# Altium schematic sheet BANK12-13.SchDoc
size A4
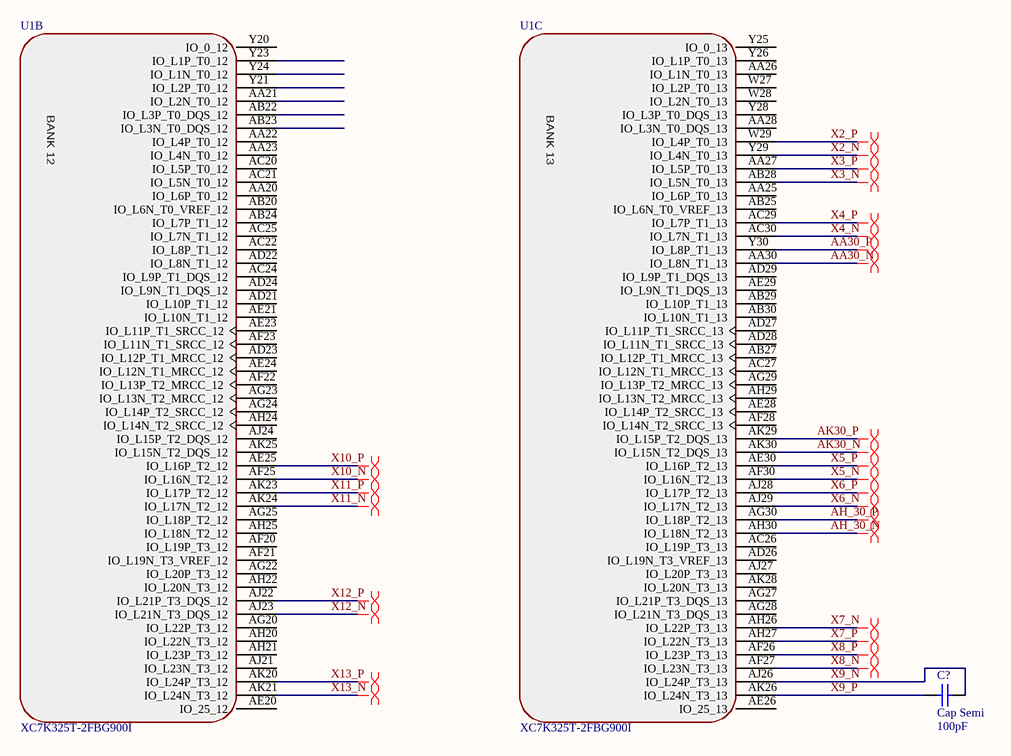
[diagram p0: BANK12-13.SchDoc]

## Parts
C?  Cap Semi  value 100pF  [C1206]
U1  XC7K325T-2FBG900I  [FBG900]  (parts B,C of 17)

## Nets
AA30_N: U1.AA30(IO_L8N_T1_13)
AA30_P: U1.Y30(IO_L8P_T1_13)
AH_30_N: U1.AH30(IO_L18N_T2_13)
AH_30_P: U1.AG30(IO_L18P_T2_13)
AK30_N: U1.AK30(IO_L15N_T2_DQS_13)
AK30_P: U1.AK29(IO_L15P_T2_DQS_13)
X2_N: U1.Y29(IO_L4N_T0_13)
X2_P: U1.W29(IO_L4P_T0_13)
X3_N: U1.AB28(IO_L5N_T0_13)
X3_P: U1.AA27(IO_L5P_T0_13)
X4_N: U1.AC30(IO_L7N_T1_13)
X4_P: U1.AC29(IO_L7P_T1_13)
X5_N: U1.AF30(IO_L16N_T2_13)
X5_P: U1.AE30(IO_L16P_T2_13)
X6_N: U1.AJ29(IO_L17N_T2_13)
X6_P: U1.AJ28(IO_L17P_T2_13)
X7_N: U1.AH26(IO_L22P_T3_13)
X7_P: U1.AH27(IO_L22N_T3_13)
X8_N: U1.AF27(IO_L23N_T3_13)
X8_P: U1.AF26(IO_L23P_T3_13)
X9_N: C?.2 U1.AJ26(IO_L24P_T3_13)
X9_P: C?.1 U1.AK26(IO_L24N_T3_13)
X10_N: U1.AF25(IO_L16N_T2_12)
X10_P: U1.AE25(IO_L16P_T2_12)
X11_N: U1.AK24(IO_L17N_T2_12)
X11_P: U1.AK23(IO_L17P_T2_12)
X12_N: U1.AJ23(IO_L21N_T3_DQS_12)
X12_P: U1.AJ22(IO_L21P_T3_DQS_12)
X13_N: U1.AK21(IO_L24N_T3_12)
X13_P: U1.AK20(IO_L24P_T3_12)

Not connected (* = marked no-connect by the designer): U1 AA20(IO_L6P_T0_12) AA21(IO_L2N_T0_12) AA22(IO_L4P_T0_12) AA23(IO_L4N_T0_12) AA25(IO_L6P_T0_13) AA26(IO_L1N_T0_13) AA28(IO_L3N_T0_DQS_13) AB20(IO_L6N_T0_VREF_12) AB22(IO_L3P_T0_DQS_12) AB23(IO_L3N_T0_DQS_12) AB24(IO_L7P_T1_12) AB25(IO_L6N_T0_VREF_13) AB27(IO_L12P_T1_MRCC_13) AB29(IO_L10P_T1_13) AB30(IO_L10N_T1_13) AC20(IO_L5P_T0_12) AC21(IO_L5N_T0_12) AC22(IO_L8P_T1_12) AC24(IO_L9P_T1_DQS_12) AC25(IO_L7N_T1_12) AC26(IO_L19P_T3_13) AC27(IO_L12N_T1_MRCC_13) AD21(IO_L10P_T1_12) AD22(IO_L8N_T1_12) AD23(IO_L12P_T1_MRCC_12) AD24(IO_L9N_T1_DQS_12) AD26(IO_L19N_T3_VREF_13) AD27(IO_L11P_T1_SRCC_13) AD28(IO_L11N_T1_SRCC_13) AD29(IO_L9P_T1_DQS_13) AE20(IO_25_12) AE21(IO_L10N_T1_12) AE23(IO_L11P_T1_SRCC_12) AE24(IO_L12N_T1_MRCC_12) AE26(IO_25_13) AE28(IO_L14P_T2_SRCC_13) AE29(IO_L9N_T1_DQS_13) AF20(IO_L19P_T3_12) AF21(IO_L19N_T3_VREF_12) AF22(IO_L13P_T2_MRCC_12) AF23(IO_L11N_T1_SRCC_12) AF28(IO_L14N_T2_SRCC_13) AG20(IO_L22P_T3_12) AG22(IO_L20P_T3_12) AG23(IO_L13N_T2_MRCC_12) AG24(IO_L14P_T2_SRCC_12) AG25(IO_L18P_T2_12) AG27(IO_L21P_T3_DQS_13) AG28(IO_L21N_T3_DQS_13) AG29(IO_L13P_T2_MRCC_13) AH20(IO_L22N_T3_12) AH21(IO_L23P_T3_12) AH22(IO_L20N_T3_12) AH24(IO_L14N_T2_SRCC_12) AH25(IO_L18N_T2_12) AH29(IO_L13N_T2_MRCC_13) AJ21(IO_L23N_T3_12) AJ24(IO_L15P_T2_DQS_12) AJ27(IO_L20P_T3_13) AK25(IO_L15N_T2_DQS_12) AK28(IO_L20N_T3_13) W27(IO_L2P_T0_13) W28(IO_L2N_T0_13) Y20(IO_0_12) Y21(IO_L2P_T0_12) Y23(IO_L1P_T0_12) Y24(IO_L1N_T0_12) Y25(IO_0_13) Y26(IO_L1P_T0_13) Y28(IO_L3P_T0_DQS_13)

## Layout directives
differential pair: AA30_N, AA30_P, AH_30_N, AH_30_P, AK30_N, AK30_P, X2_N, X2_P, X3_N, X3_P, X4_N, X4_P, X5_N, X5_P, X6_N, X6_P, X7_N, X7_P, X8_N, X8_P, X10_N, X10_P, X11_N, X11_P, X12_N, X12_P, X13_N, X13_P

## Notes on the sheet
- (in symbol XC7K325T-2FBG900I, part B) BANK 12
- (in symbol XC7K325T-2FBG900I, part C) BANK 13

## Library data of the parts
C? = Cap Semi: Capacitor (Semiconductor SIM Model); Published: 8-Jun-2000; LatestRevisionDate: 29-May-2009; LatestRevisionNote: IPC-7351 Footprint Added.; PackageReference: C1206; Publisher: Altium Limited; PackageDescription: Chip Capacitor